# Altium schematic sheet powersupply.SchDoc: Voltage regulation
size A4; SheetNumber: 3; SheetTotal: 5
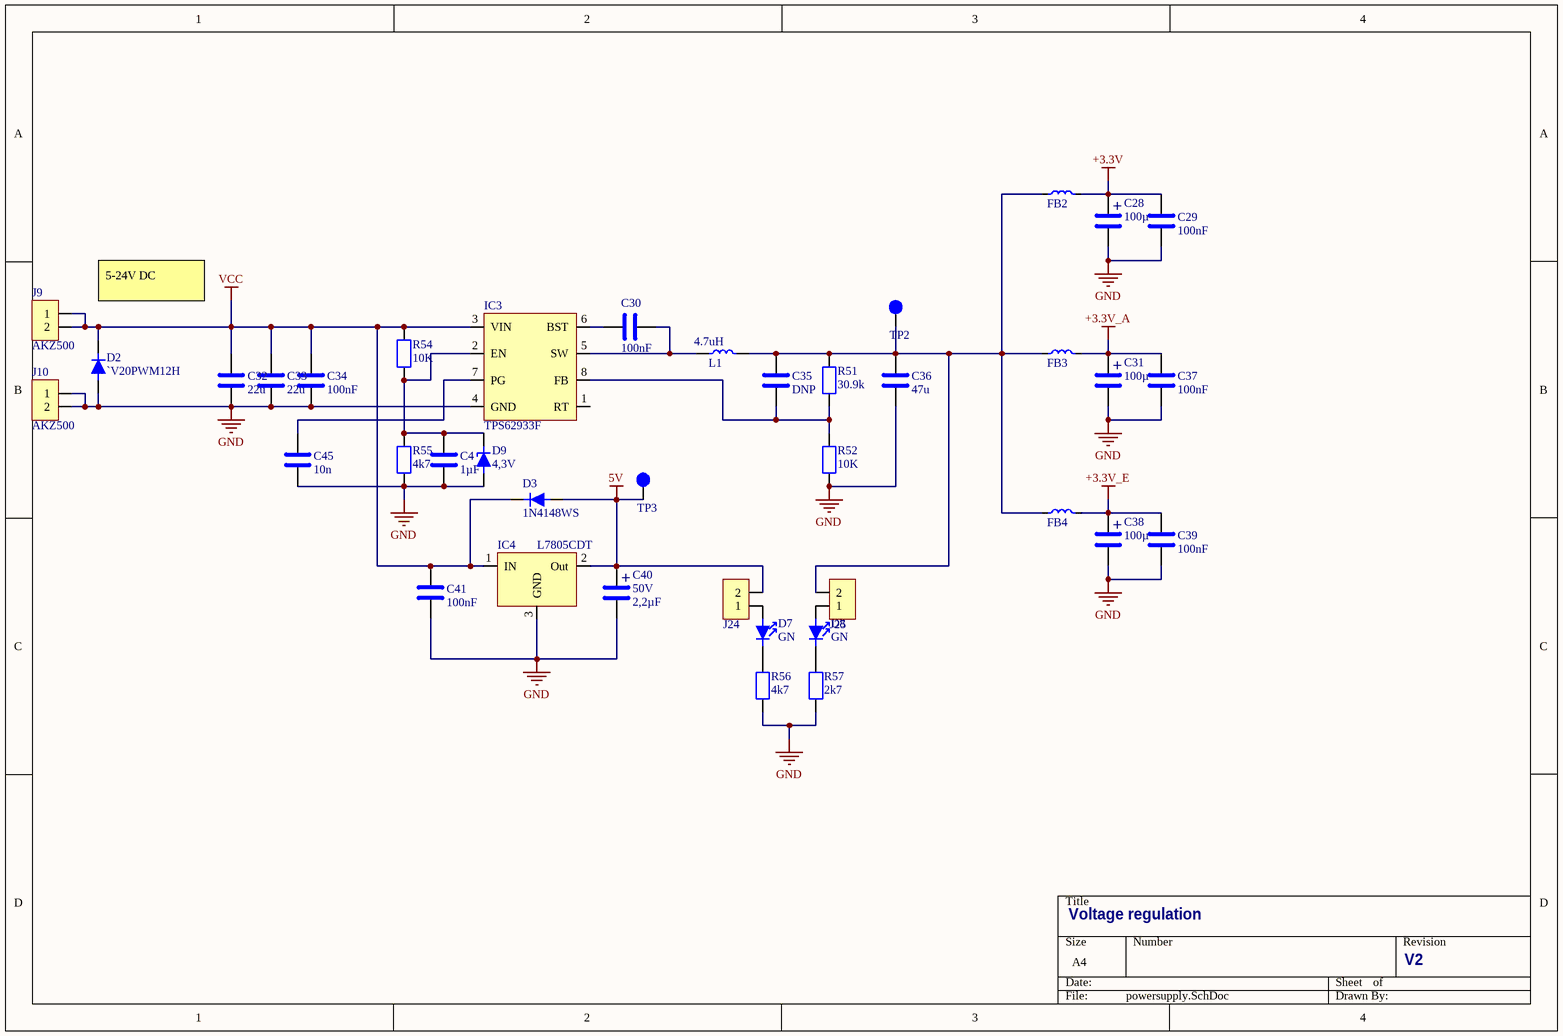
[diagram p0: powersupply.SchDoc]

## Parts
C4  value 1µF  [0805]  (hidden comment: 1µF 25V MLCC 0805)
C28  value 100µ  [PANASONIC_C]  (hidden comment: Elko_100uF_16V_PanasonicC)
C29  value 100nF  [0603]  (hidden comment: 100nF 50V MLCC 0603)
C30  value 100nF  [0603]  (hidden comment: 100nF 50V MLCC 0603)
C31  value 100µ  [PANASONIC_C]  (hidden comment: Elko_100uF_16V_PanasonicC)
C32  value 22u  [1210]  (hidden comment: 22uF 35V X5R 1210)
C33  value 22u  [1210]  (hidden comment: 22uF 35V X5R 1210)
C34  value 100nF  [0603]  (hidden comment: 100nF 50V MLCC 0603)
C35  value DNP  [0603]  (hidden comment: 47pF MLCC 0603)
C36  value 47u  [1210]  (hidden comment: 47uF 16V X7R 1210)
C37  value 100nF  [0603]  (hidden comment: 100nF 50V MLCC 0603)
C38  value 100µ  [PANASONIC_C]  (hidden comment: Elko_100uF_16V_PanasonicC)
C39  value 100nF  [0603]  (hidden comment: 100nF 50V MLCC 0603)
C40  voltage: 50V  capacitance: 2,2µF  [SIZE_B]  (hidden comment: 2,2µF 50V Size B Elko)
C41  value 100nF  [0603]  (hidden comment: 100nF 50V MLCC 0603)
C45  value 10n  [0603]  (hidden comment: 10nF 50V MLCC 0603)
D2  `V20PWM12H  [TO-252AE]
D3  1N4148WS  [SOD323]
D7  GN  [G0805]
D8  GN  [G0805]
D9  value 4,3V  [SOD323]  (hidden comment: BZT52-C4V3S_R1_00001)
FB2  HI1206N101R-10  [1206]  (value not drawn)
FB3  HI1206N101R-10  [1206]  (value not drawn)
FB4  HI1206N101R-10  [1206]  (value not drawn)
IC3  TPS62933F  [SOT583-8]
IC4  L7805CDT  [D-PAK]
J9  AKZ500  [AKZ500/2]
J10  AKZ500  [AKZ500/2]
J24  SL 1X2G 2,54  [SL_1x2 2.54mm]  (value not drawn)
J25  SL 1X2G 2,54  [SL_1x2 2.54mm]  (value not drawn)
L1  value 4.7uH  [BOURNS SRN5040]  (hidden comment: SRN5040-4R7M)
R51  value 30.9k  [res0603]  (hidden comment: 30k9 100mW 0603)
R52  value 10K  [res0603]  (hidden comment: 10K 100mW 0603)
R54  value 10K  [res0603]  (hidden comment: 10K 100mW 0603)
R55  value 4k7  [res0603]  (hidden comment: 4k7 100mW 0603)
R56  value 4k7  [res0603]  (hidden comment: 4k7 100mW 0603)
R57  value 2k7  [res0603]  (hidden comment: 2k7 100mW 0603)
TP2  testpoint  [testpoint]  (value not drawn)
TP3  testpoint  [testpoint]  (value not drawn)

## Nets
5V: C40.1 D3.2 IC4.2(Out) J24.2 TP3.1
+3.3V: C28.+ C29.1 FB2.2
+3.3V_A: C31.+ C37.1 FB3.2
+3.3V_E: C38.+ C39.1 FB4.2
GND: C4.2 C28.- C29.2 C31.- C32.2 C33.2 C34.2 C36.2 C37.2 C38.- C39.2 C40.2 C41.1 C45.2 D2.2 D9.2 IC3.4(GND) IC4.3(GND) J10.1 J10.2 R52.1 R55.1 R56.1 R57.1
VCC: C32.1 C33.1 C34.1 C41.2 D2.1 D3.1 IC3.3(VIN) IC4.1(IN) J9.1 J9.2 R54.2
NetC4_1: C4.1 D9.1 IC3.2(EN) R54.1 R55.2
NetC30_1: C30.1 IC3.6(BST)
NetC30_2: C30.2 IC3.5(SW) L1.1
NetC35_1: C35.1 C36.1 FB2.1 FB3.1 FB4.1 J25.2 L1.2 R51.2 TP2.1
NetC35_2: C35.2 IC3.8(FB) R51.1 R52.2
NetC45_1: C45.1 IC3.7(PG)
NetD7_1: D7.1 R56.2
NetD7_2: D7.2 J24.1
NetD8_1: D8.1 R57.2
NetD8_2: D8.2 J25.1

Not connected (* = marked no-connect by the designer): IC3 1(RT)

## Notes on the sheet
- 5-24V DC
- Voltage regulation
- V2
- (in symbol 2,2µF 50V Size B Elko) +

## Library data of the parts
C4 = 1µF 25V MLCC 0805: Reichelt code: KEM X5R0805 1,0U; dielectricum: X5R; voltage: 25V; lcsc code: C35795; mouser code: 187-CL21B105KAFNFNE; storage: AIDETEK; storageID: 181
C28 C31 C38 = Elko_100uF_16V_PanasonicC: voltage: 16V; mouser code: 667-16SVPC100M
C29 C30 C34 C37 C39 C41 = 100nF 50V MLCC 0603: Reichelt code: X7R-G0603 100N; dielectricum: X7R; voltage: 50V; mouser code: 80-C0603X104K3R; storage: AIDTEKBox | Röhrchen; storageID: 18 | F7; lcsc code: C2252264
C35 = 47pF MLCC 0603: 680pF 50V MLCC 0603; dielectricum: NPO; lcsc code: C94904; mouser code: 187-CL10C470JC81PNC
C40 = 2,2µF 50V Size B Elko: reichelt code: VF 2,2/50 C-B
C45 = 10nF 50V MLCC 0603: Reichelt code: X7R-G0603 10N; dielectricum: X7R; voltage: 50V
D2 = V20PWM12HM3: 20A high power diode; mouser code: 78-V20PWM12HM3/I; storage: AIDETEK; storageID: 190
D3 = 1N4148WS: Small signal diode; mouser code: 512-1N4148WS; storage: AIDETEK; storageID: 189
D7 D8 = G0805 LED GN: If: 20mA; Vf: 2.2V; reichelt code: SMD-LED 0805 GN
D9 = BZT52C4V3SR10000: 4,3V Z-Diode; mouser code: 241-BZT52C4V3SR10000
FB2-FB4 = HI1206N101R-10: 3A ferrit bead; mouser code: 875-HI1206N101R-10; storage: AIDETEK; storageIDE: 188
IC4 = L7805CDT: 5V Spannungsregler D-PAK; mouser code: 511-L7805CDT-TR
J9 J10 = AKZ500/2: mouser code: 845-34.102
J24 J25 = SL 1X2G 2,54: Stiftleiste 2pol 2.54mm; reichelt code: SL 1X50G 2,54
R51 = 30k9 100mW 0603: Tolerance: 1%; mouser code: 652-CR0603-FX3092ELF; Power rating: 100mW; storageID: 178; storage: AIDTEKBox
R52 R54 = 10K 100mW 0603: Tolerance: 1%; Reichelt code: SMD-0603 10K; Power rating: 100mW; mouser code: 603-RE0603FRE0710KL; storage: AIDTEKBox; storageID: 4
R57 = 2k7 100mW 0603: Tolerance: 1%; Power rating: 100mW; mouser code: 603-RE0603FRE072K7L; storage: AIDTEKBox; storageID: 2
C32 C33 = 22uF 35V X5R 1210: voltage: 35V; mouser code: 963-GMK325BJ226MM-P; storage: AIDETEK; storageID: 183
C36 = 47uF 16V X7R 1210: mouser part: GRM32ER61C476KE15L; voltage: 16V; lcsc code: C77101; storage: AIDETEK; storageID: 184
IC3 = TPS62933F: mouser code: 595-TPS62933FDRLR; storage: AIDETEK; storageID: 185
L1 = SRN5040-4R7M: mouser code: 652-SRN5040-4R7M; storage: AIDETEK; storageID: 198
R55 R56 = 4k7 100mW 0603: mouser code: 603-RE0603FRE074K7L; Power rating: 100mW; storage: AIDTEKBox; storageID: 5